# Altium schematic sheet ICE.SchDoc: TE0888 - ICE
size A4; PageSetup: Record=PageOptions|CenterHorizontal=True|CenterVertical=True|PrintScale=0.96|XCorrection=1.00|YCorrection=1.00|PrintKind=0|BorderSize=5000000|LeftOffset=0|BottomOffset=0|Orientation=2|PaperLength=1000|PaperWidth=1000|Scale=100|PaperSource=7|PrintQuality=-4|MediaType=1|DitherType=10|PaperKind=A4|PrintScaleMode=1; Organization: Trenz Electronic GmbH; DocumentNumber: TE0888; Revision: 01; SheetNumber: 3; SheetTotal: 5; Date: 20.05.2015; CompanyName: Trenz Electronic GmbH; ProjectName: TE0888
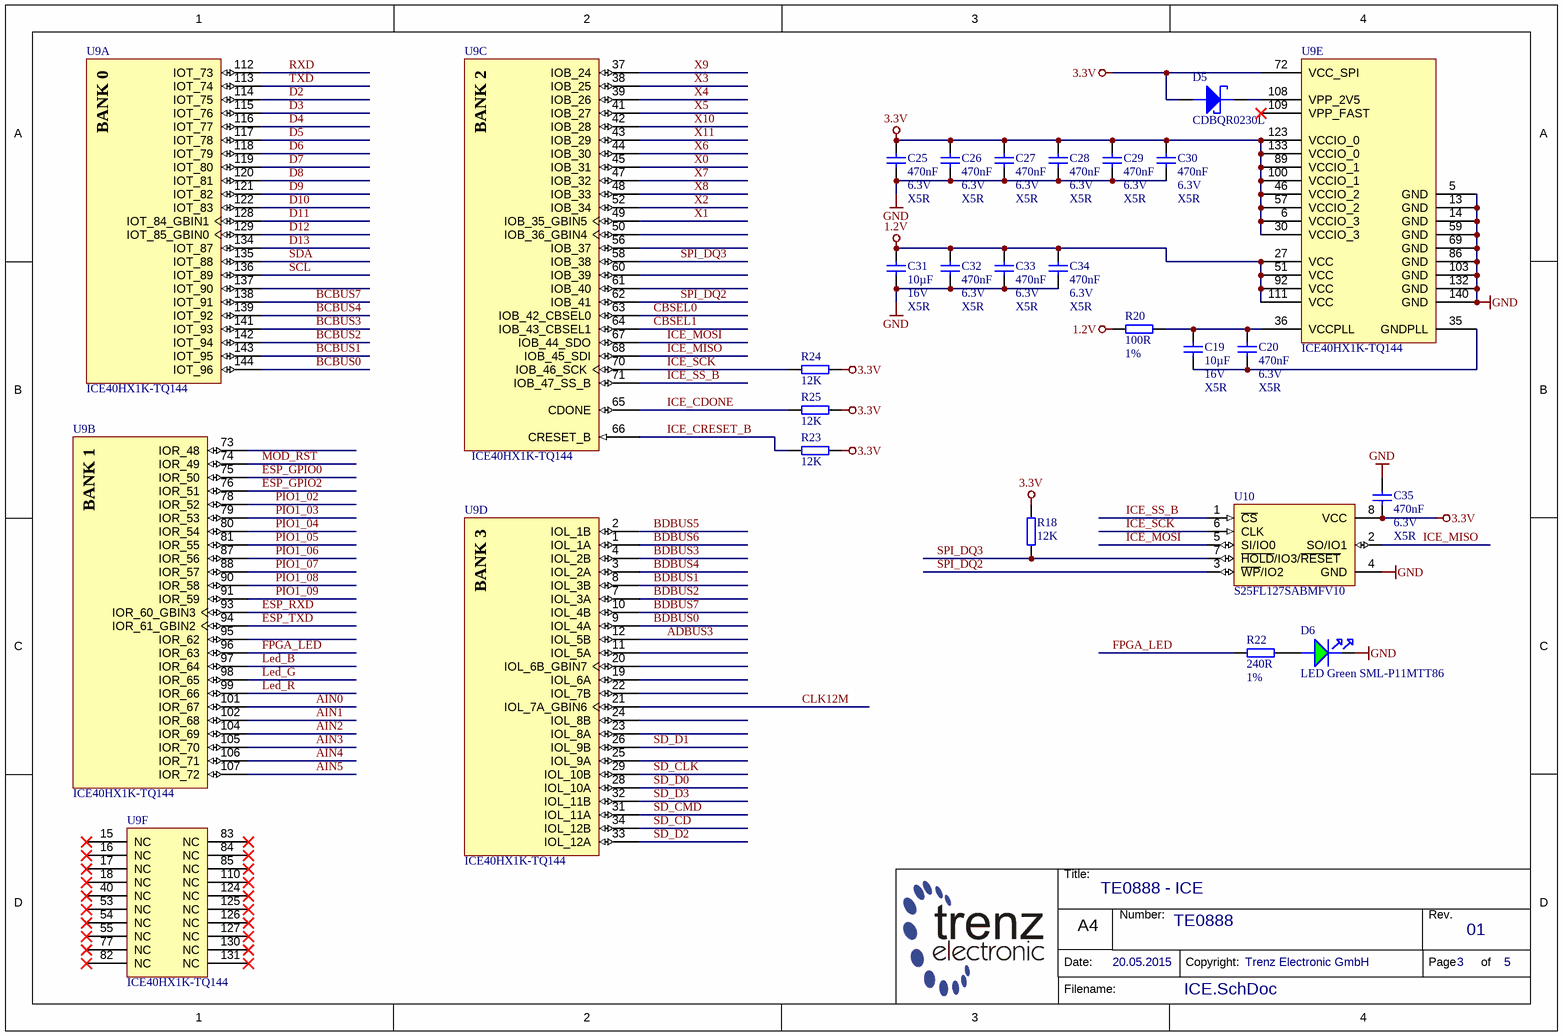
[diagram p0: ICE.SchDoc]

## Parts
C19  10µF  Voltage: 16V  Technology: X5R  [CAPC1608X90N]
C20  470nF  Voltage: 6.3V  Technology: X5R  [CAPC0603X33N]
C25  470nF  Voltage: 6.3V  Technology: X5R  [CAPC0603X33N]
C26  470nF  Voltage: 6.3V  Technology: X5R  [CAPC0603X33N]
C27  470nF  Voltage: 6.3V  Technology: X5R  [CAPC0603X33N]
C28  470nF  Voltage: 6.3V  Technology: X5R  [CAPC0603X33N]
C29  470nF  Voltage: 6.3V  Technology: X5R  [CAPC0603X33N]
C30  470nF  Voltage: 6.3V  Technology: X5R  [CAPC0603X33N]
C31  10µF  Voltage: 16V  Technology: X5R  [CAPC1608X90N]
C32  470nF  Voltage: 6.3V  Technology: X5R  [CAPC0603X33N]
C33  470nF  Voltage: 6.3V  Technology: X5R  [CAPC0603X33N]
C34  470nF  Voltage: 6.3V  Technology: X5R  [CAPC0603X33N]
C35  470nF  Voltage: 6.3V  Technology: X5R  [CAPC0603X33N]
D5  CDBQR0230L  [DIOC1006X55N]
D6  LED Green SML-P11MTT86  [LEDC1006X25N_GREEN]
R18  12K  [RESC1005X40N]
R20  100R  Tolerance: 1%  [RESC1005X40N]
R22  240R  Tolerance: 1%  [RESC1005X40N]
R23  12K  [RESC1005X40N]
R24  12K  [RESC1005X40N]
R25  12K  [RESC1005X40N]
U9  ICE40HX1K-TQ144  [LATC-TQFP-144_N]  (parts A,B,C,D,E,F of 6)
U10  S25FL127SABMFV10  [SOIC127P790X216-8N]

## Nets
1.2V: C31.1 C32.2 C33.2 C34.2 R20.1 U9.27(VCC) U9.51(VCC) U9.92(VCC) U9.111(VCC)
3.3V: C25.2 C26.2 C27.2 C28.2 C29.2 C30.2 C35.1 D5.2(ANODE) R18.1 R23.1 R24.1 R25.1 U9.6(VCCIO_3) U9.30(VCCIO_3) U9.46(VCCIO_2) U9.57(VCCIO_2) U9.72(VCC_SPI) U9.89(VCCIO_1) U9.100(VCCIO_1) U9.123(VCCIO_0) U9.133(VCCIO_0) U10.8(VCC)
GND: C25.1 C26.1 C27.1 C28.1 C29.1 C30.1 C31.2 C32.1 C33.1 C34.1 C35.2 D6.K U9.5(GND) U9.13(GND) U9.14(GND) U9.59(GND) U9.69(GND) U9.86(GND) U9.103(GND) U9.132(GND) U9.140(GND) U10.4(GND)
ADBUS3: U9.12(IOL_5B)
AIN0: U9.101(IOR_67)
AIN1: U9.102(IOR_68)
AIN2: U9.104(IOR_69)
AIN3: U9.105(IOR_70)
AIN4: U9.106(IOR_71)
AIN5: U9.107(IOR_72)
BCBUS0: U9.144(IOT_96)
BCBUS1: U9.143(IOT_95)
BCBUS2: U9.142(IOT_94)
BCBUS3: U9.141(IOT_93)
BCBUS4: U9.139(IOT_92)
BCBUS7: U9.138(IOT_91)
BDBUS0: U9.9(IOL_4A)
BDBUS1: U9.8(IOL_3B)
BDBUS2: U9.7(IOL_3A)
BDBUS3: U9.4(IOL_2B)
BDBUS4: U9.3(IOL_2A)
BDBUS5: U9.2(IOL_1B)
BDBUS6: U9.1(IOL_1A)
BDBUS7: U9.10(IOL_4B)
CBSEL0: U9.63(IOB_42_CBSEL0)
CBSEL1: U9.64(IOB_43_CBSEL1)
CLK12M: U9.21(IOL_7A_GBIN6)
D2: U9.114(IOT_75)
D3: U9.115(IOT_76)
D4: U9.116(IOT_77)
D5: U9.117(IOT_78)
D6: U9.118(IOT_79)
D7: U9.119(IOT_80)
D8: U9.120(IOT_81)
D9: U9.121(IOT_82)
D10: U9.122(IOT_83)
D11: U9.128(IOT_84_GBIN1)
D12: U9.129(IOT_85_GBIN0)
D13: U9.134(IOT_87)
ESP_GPIO0: U9.75(IOR_50)
ESP_GPIO2: U9.76(IOR_51)
ESP_RXD: U9.93(IOR_60_GBIN3)
ESP_TXD: U9.94(IOR_61_GBIN2)
FPGA_LED: R22.2 U9.96(IOR_63)
ICE_CDONE: R25.2 U9.65(CDONE)
ICE_CRESET_B: R23.2 U9.66(CRESET_B)
ICE_MISO: U9.68(IOB_45_SDI) U10.2(SO/IO1)
ICE_MOSI: U9.67(IOB_44_SDO) U10.5(SI/IO0)
ICE_SCK: R24.2 U9.70(IOB_46_SCK) U10.6(CLK)
ICE_SS_B: U9.71(IOB_47_SS_B) U10.1(~{CS})
Led_B: U9.97(IOR_64)
Led_G: U9.98(IOR_65)
Led_R: U9.99(IOR_66)
MOD_RST: U9.74(IOR_49)
PIO1_02: U9.78(IOR_52)
PIO1_03: U9.79(IOR_53)
PIO1_04: U9.80(IOR_54)
PIO1_05: U9.81(IOR_55)
PIO1_06: U9.87(IOR_56)
PIO1_07: U9.88(IOR_57)
PIO1_08: U9.90(IOR_58)
PIO1_09: U9.91(IOR_59)
RXD: U9.112(IOT_73)
SCL: U9.136(IOT_89)
SD_CD: U9.34(IOL_12B)
SD_CLK: U9.29(IOL_10B)
SD_CMD: U9.31(IOL_11A)
SD_D0: U9.28(IOL_10A)
SD_D1: U9.26(IOL_9B)
SD_D2: U9.33(IOL_12A)
SD_D3: U9.32(IOL_11B)
SDA: U9.135(IOT_88)
SPI_DQ2: U9.62(IOB_41) U10.3(~{WP}/IO2)
SPI_DQ3: R18.2 U9.58(IOB_38) U10.7(~{HOLD}/IO3/~{RESET})
TXD: U9.113(IOT_74)
X0: U9.45(IOB_31)
X1: U9.49(IOB_35_GBIN5)
X2: U9.52(IOB_34)
X3: U9.38(IOB_25)
X4: U9.39(IOB_26)
X5: U9.41(IOB_27)
X6: U9.44(IOB_30)
X7: U9.47(IOB_32)
X8: U9.48(IOB_33)
X9: U9.37(IOB_24)
X10: U9.42(IOB_28)
X11: U9.43(IOB_29)
NetC19_1: C19.1 C20.2 R20.2 U9.36(VCCPLL)
NetC19_2: C19.2 C20.1 U9.35(GNDPLL)
NetD5_1: D5.1(KATHODE) U9.108(VPP_2V5)
NetD6_A: D6.A R22.1

Not connected (* = marked no-connect by the designer): U9 11(IOL_5A) 15(NC)* 16(NC)* 17(NC)* 18(NC)* 19(IOL_6A) 20(IOL_6B_GBIN7) 22(IOL_7B) 23(IOL_8A) 24(IOL_8B) 25(IOL_9A) 40(NC)* 50(IOB_36_GBIN4) 53(NC)* 54(NC)* 55(NC)* 56(IOB_37) 60(IOB_39) 61(IOB_40) 73(IOR_48) 77(NC)* 82(NC)* 83(NC)* 84(NC)* 85(NC)* 95(IOR_62) 109(VPP_FAST)* 110(NC)* 124(NC)* 125(NC)* 126(NC)* 127(NC)* 130(NC)* 131(NC)* 137(IOT_90)

## Notes on the sheet
- Title:
- Number:
- Rev.
- Date:
- A4
- Copyright:
- Page
- of
- Filename:
- (in symbol ICE40HX1K-TQ144, part A) BANK 0
- (in symbol ICE40HX1K-TQ144, part B) BANK 1
- (in symbol ICE40HX1K-TQ144, part C) BANK 2
- (in symbol ICE40HX1K-TQ144, part D) BANK 3

## Library data of the parts
C19 C31 = 25341: KON 10µF 16V X5R SMD 20%; AN: 25341; Mixed: SMT; Value: 10u; Preferred: Yes; Case: 1608 (0603); Tolerance: 20%
C20 C25-C30 C32-C35 = 24921: KON 470nF X5R 6.3V SMD 20%; AN: 24921; Value: 470n; Mixed: SMT; Preferred: Yes; Case: 0603 (0201); Tolerance: 20%
D5 = 26726: AN: 26726; Mixed: SMT; Voltage: 0.2A; Value: 30V; Case: SOD-923F (0402); HelpURL: B:\ad\adlib\datasheet\CDBQR0230L
D6 = 24211: LED Grün SML-P11MTT86 SMD; AN: 24211; Mixed: SMT; Preferred: Yes; Case: 1005 (0402); HelpURL: B:\AD\adlib\datasheet\SML-P1
R18 R23-R25 = 22598: WID SMD 12K 1% 0,063W; AN: 22598; Mixed: SMT; Preferred: Yes; Case: 1005 (0402); Value: 12K
R20 = 22507: WID SMD 100R 1% 0,063W; AN: 22507; Mixed: SMT; Value: 100; Preferred: Yes; Case: 1005 (0402)
R22 = 23661: WID SMD 240R 1% 0,063W; AN: 23661; Mixed: SMT; Value: 240; Preferred: Yes; Case: 1005 (0402)
U9 = ICE40HX1K-TQ144: iCE40 HX1K Series FPGA Family, 1280 Logic Cells, 1.2 V Core, 64 K Embedded RAM Bits, 144-pin TQFP, Pb-Free, Tray; Manufacturer: Lattice Semiconductor; Embedded RAM Bits: 64K; Logic Cells: 1280; Phase-Locked Loops: 1; Supply Voltage: 1.2V; DatasheetVersion: Rev. 02.9; PackageVersion: Rev. 03.9, 02/2013; PackageReference: TQFP-144; PackageDescription: 144-Pin Thin Quad Flat Package, Body 20 x 20 mm, Pitch 0.5 mm; Supplier 1: Digi-Key; Supplier Part Number 1: 220-1565-ND; Supplier 2: Farnell; Supplier Part Number 2: 2362849; Supplier 3: Newark; Supplier Part Number 3: 20X0101; Supplier 4: Mouser; Supplier Part Number 4: 842-ICE40HX1K-TQ144; Packing: Tray; RoHS: TRUE; Mounting Technology: Surface Mount; PartNumber: ICE40HX1K-TQ144; ComponentLink1Description: Manufacturer URL; ComponentLink1URL: http://www.latticesemi.com/en; ComponentLink2Description: Datasheet; ComponentLink2URL: http://www.latticesemi.com/~/media/Documents/DataSheets/iCE/iCE40LPHXFamilyDataSheet.pdf; ComponentLink3Description: Package Specification; ComponentLink3URL: http://www.latticesemi.com/lit/docs/package/pkg.pdf
U10 = 26078: S25FL127SABMFV10 automotive SO8; AN: 26078; Mixed: SMT; Case: SO8W; HelpURL: B:\AD\adlib\datasheet\S25FL12xS